# Altium project headphones.PrjPcb
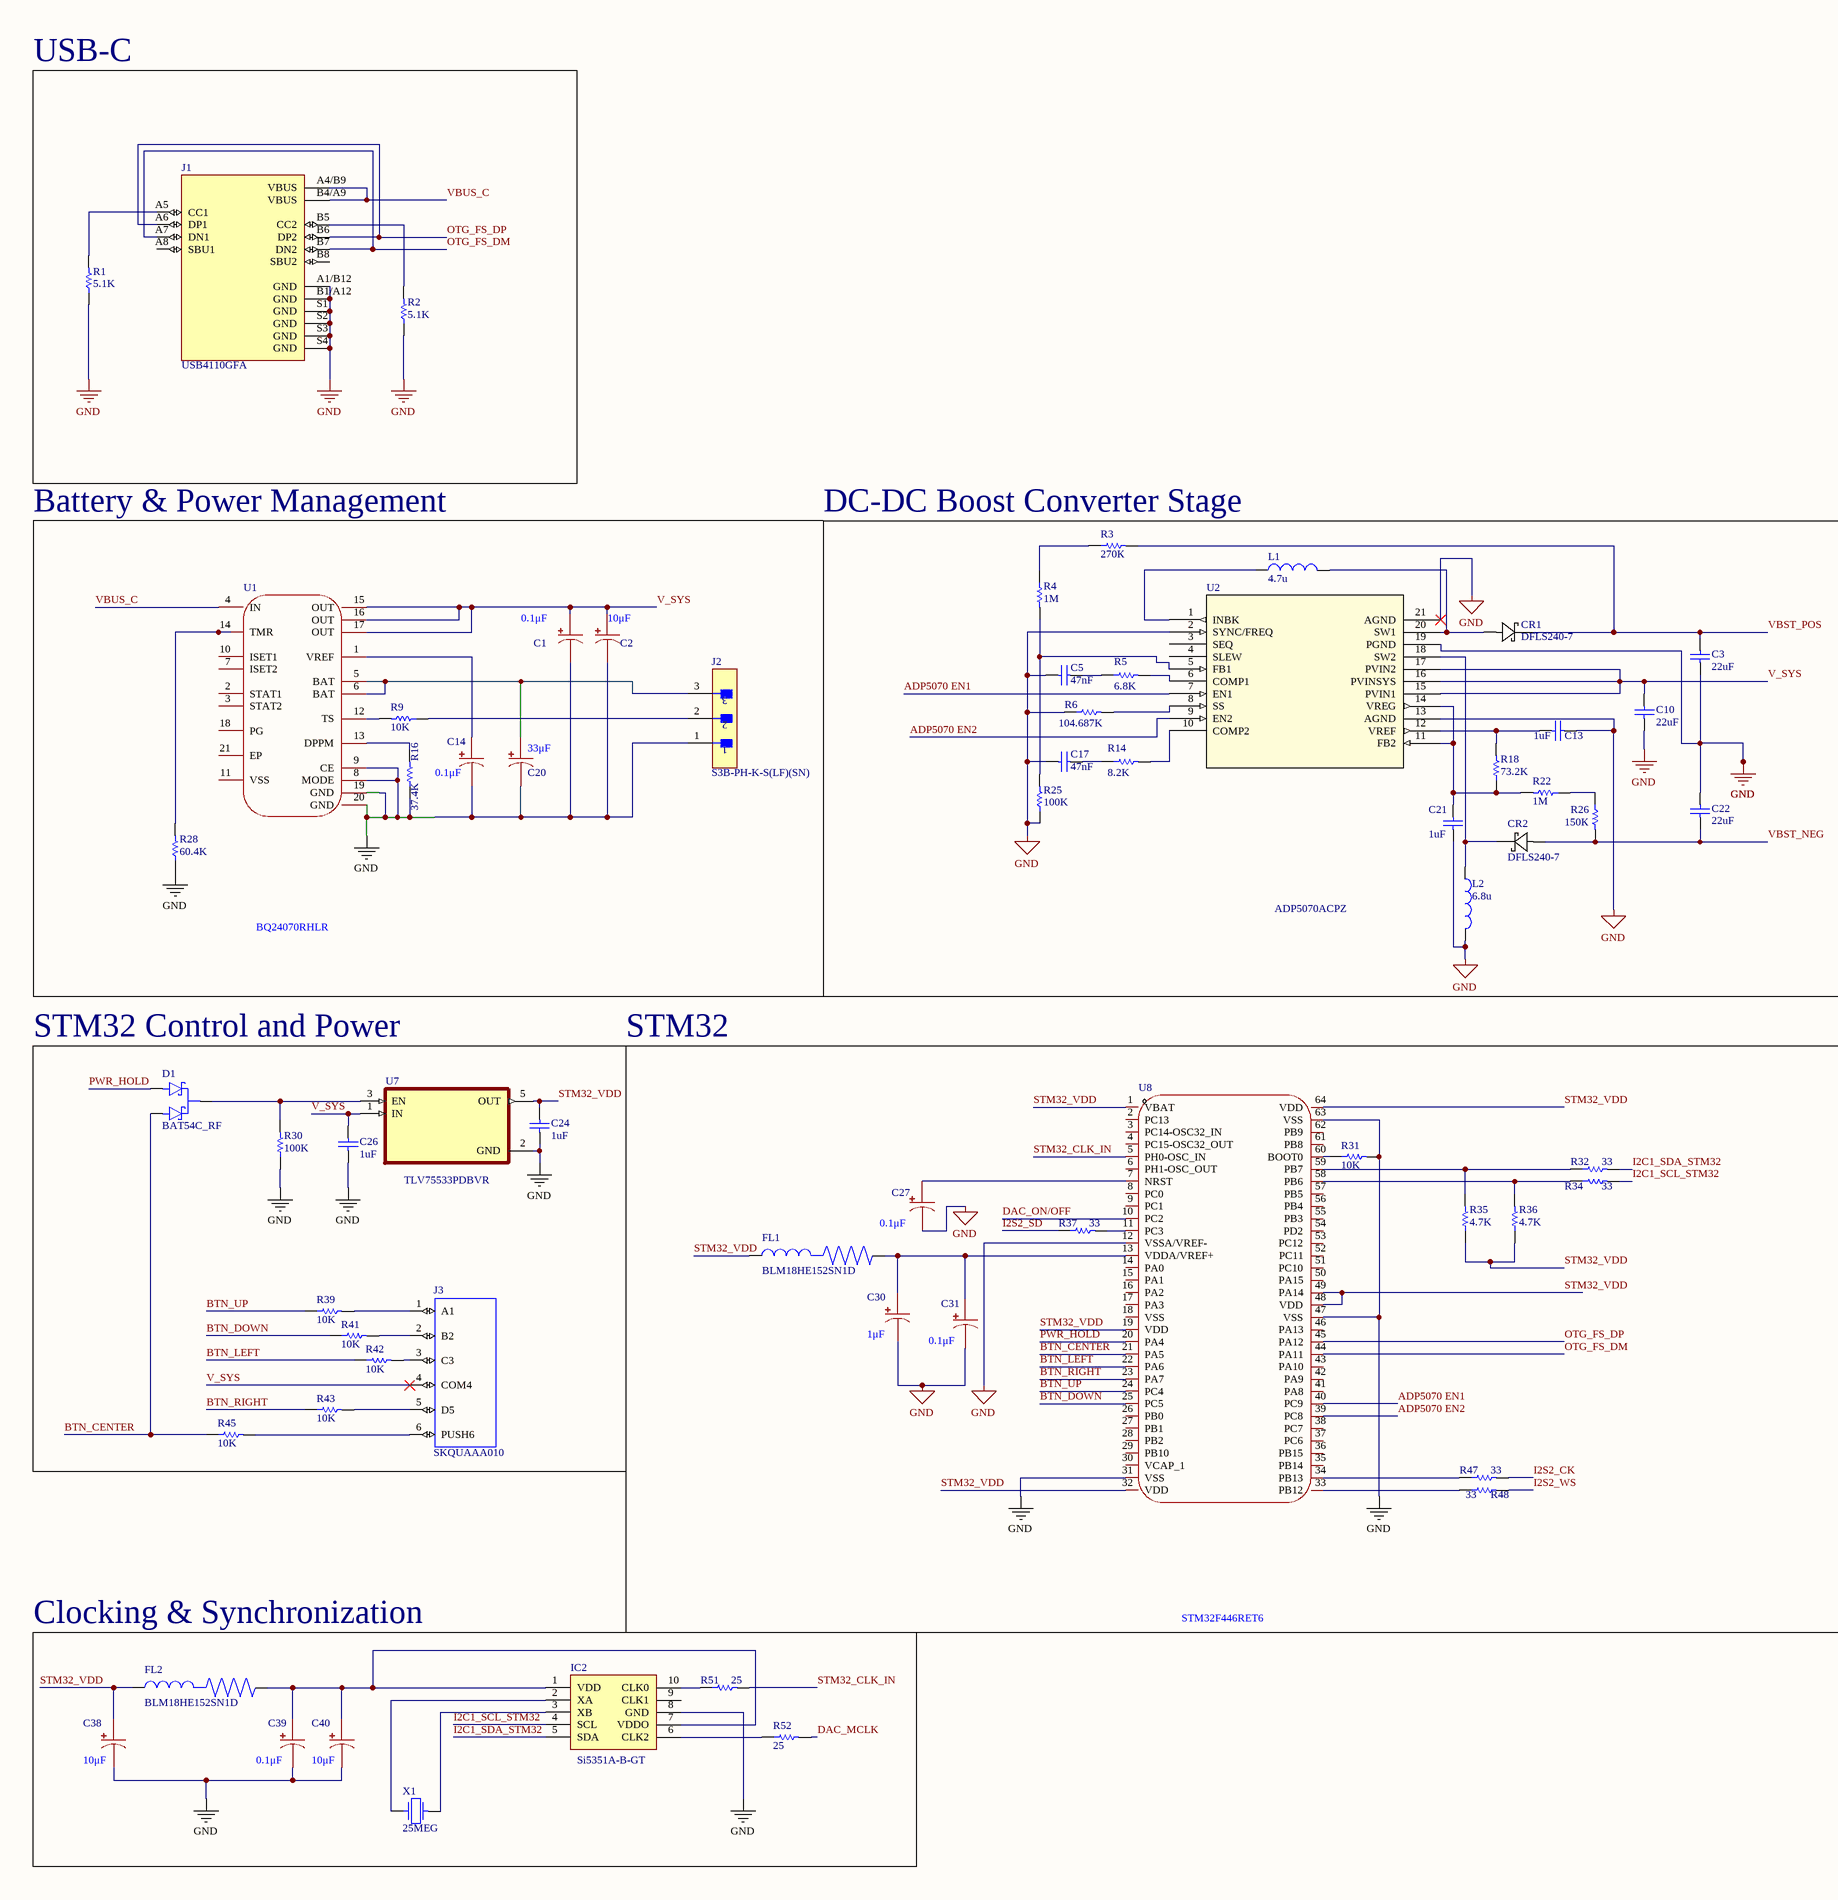
[diagram p0: 1_P1.schdoc, left]
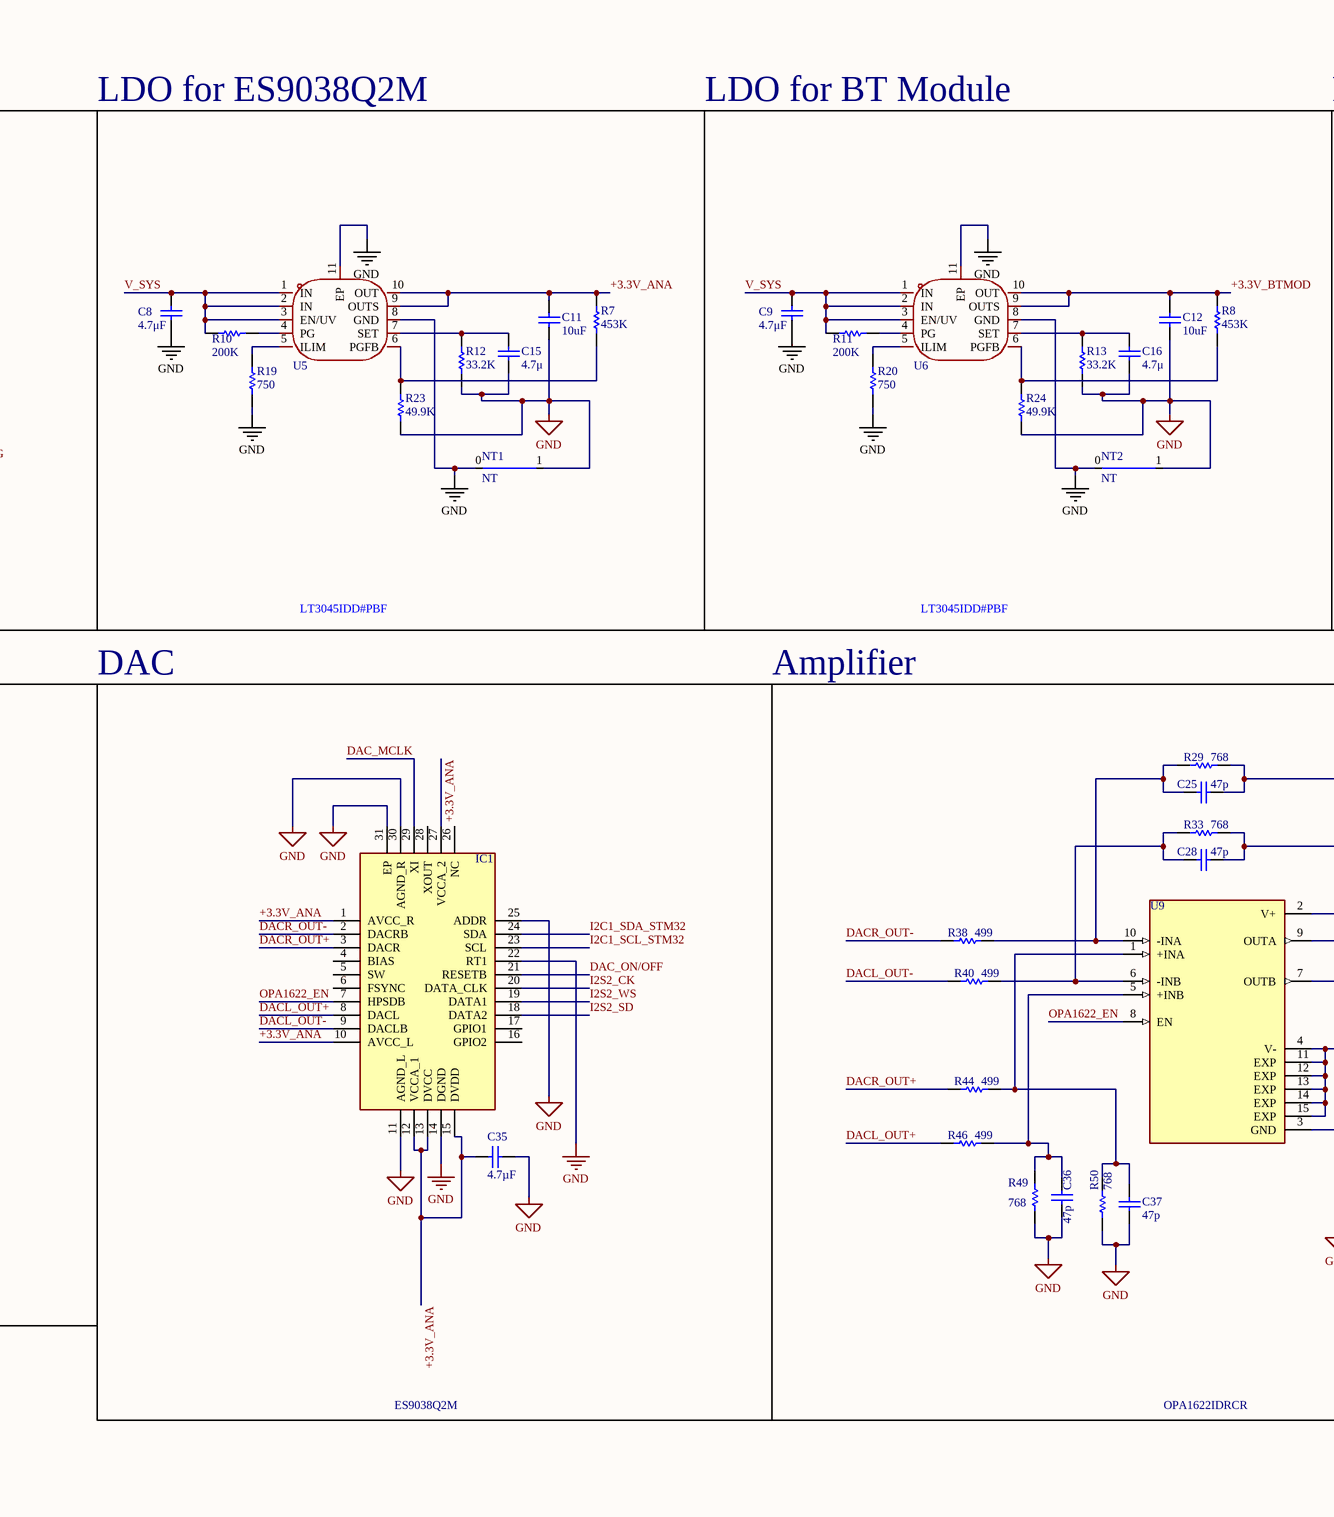
[diagram p1: 1_P1.schdoc, middle]
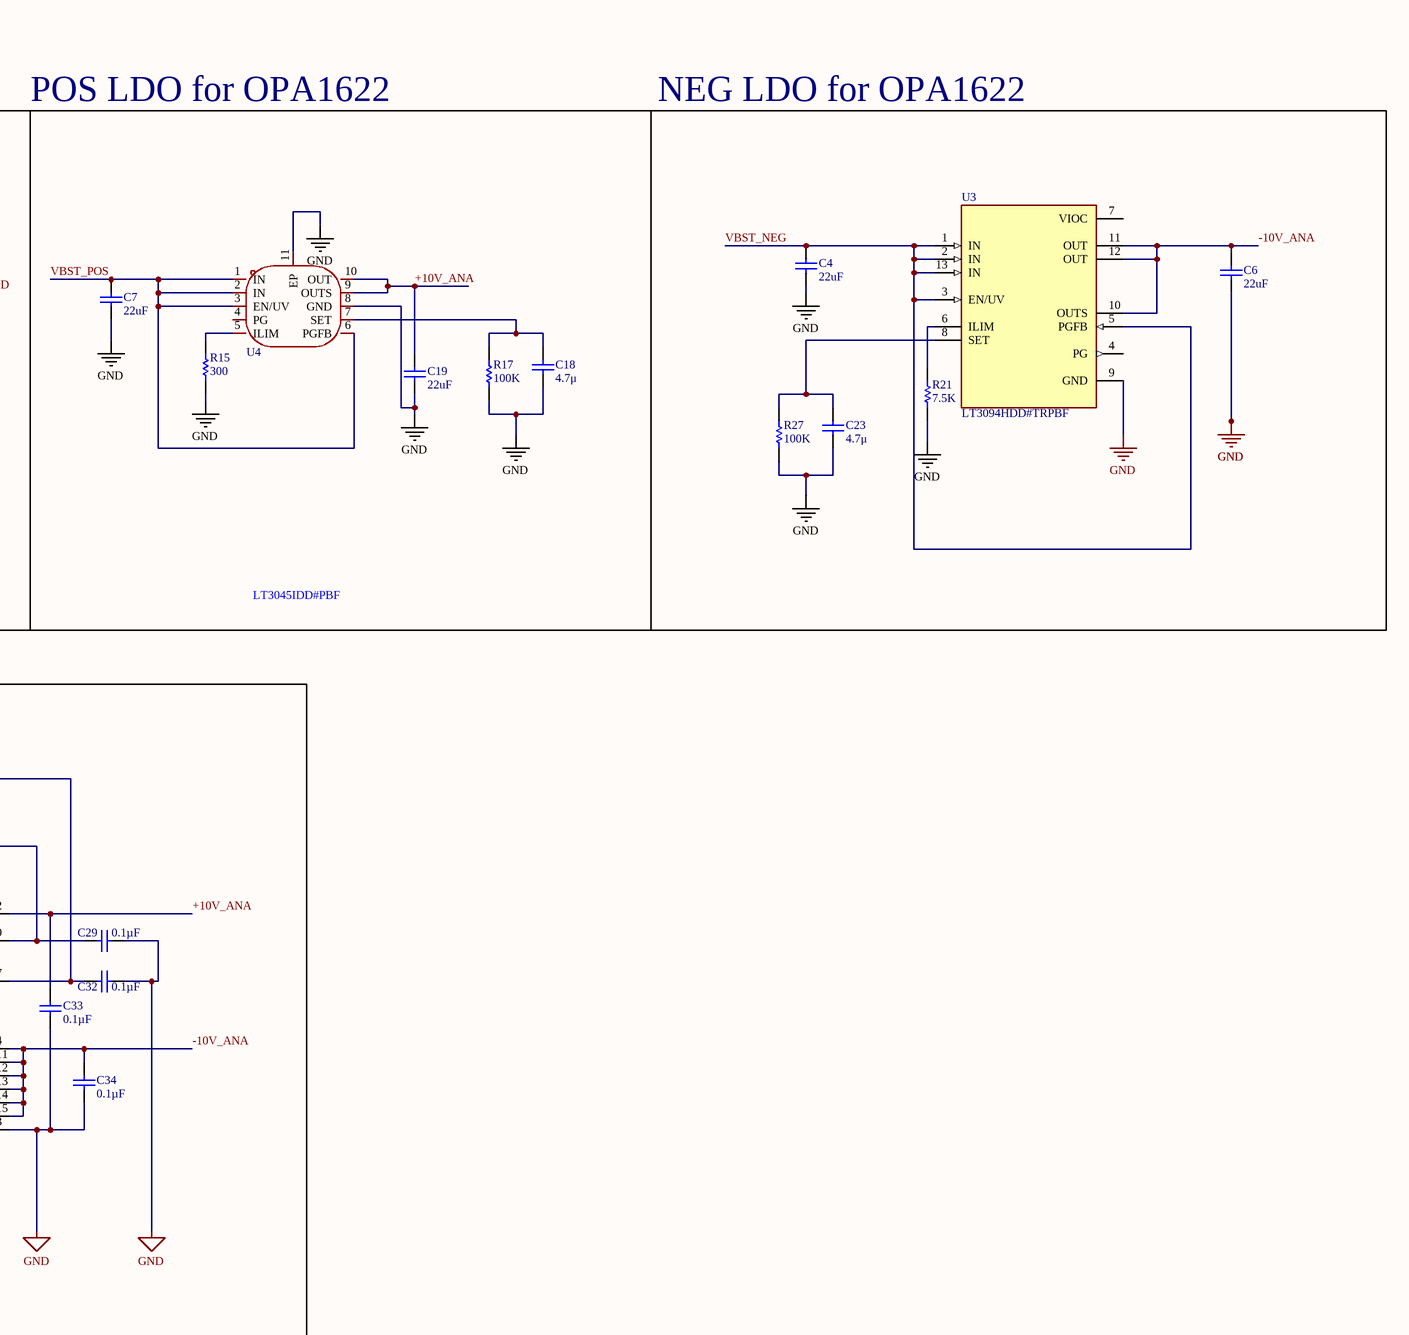
[diagram p2: 1_P1.schdoc, right]
1 sheet, 116 parts. Net scope: global (net labels, ports and power ports of the same name join across sheets).
Board file: PCB1.pcbdoc

## Sheet 1_P1.schdoc
size 1196 x 848 mm; Symbol: Drawing-Symbol_A4; Device: Drawing-Symbol_A4; @Project Name: onear_headphones; @Page Count: 1; @Update Date: 2026-01-30; @Create Date: 2025-10-09; @Schematic Name: Schematic1; @Page No: 1; @Page Name: P1; Company: EasyEDA.com; Version: V1.0; Page Size: A4; @Create Time: 20:19:40; @Update Time: 09:32:09; Width: 4676; Height: 3304; Region Start: 1; X Region Count: 6; Y Region Count: 4; Blade Width: 10; Title Block Position: 3; @Board Name: Board1; SheetNumber: 1; SheetTotal: 1

### Parts
C1  0.1μF  [FP-GRM155-0_05-MFG]
C2  10μF  [CAPC2012X145N]
C3  value 22uF  [FP-GRM32-MFG]  (hidden comment: Capacitor)
C4  value 22uF  [FP-GRM32-MFG]  (hidden comment: Capacitor)
C5  value 47nF  [FP-GRM155-0_05-MFG]  (hidden comment: Capacitor)
C6  value 22uF  [FP-GRM32-MFG]  (hidden comment: Capacitor)
C7  value 22uF  [FP-GRM32-MFG]  (hidden comment: Capacitor)
C8  value 4.7μF  [CAPC1608X95N]  (hidden comment: Capacitor)
C9  value 4.7μF  [CAPC1608X95N]  (hidden comment: Capacitor)
C10  value 22uF  [FP-GRM32-MFG]  (hidden comment: Capacitor)
C11  value 10uF  [FP-GRM32-MFG]  (hidden comment: Capacitor)
C12  value 10uF  [FP-GRM32-MFG]  (hidden comment: Capacitor)
C13  value 1uF  [CAPC1608X90N]  (hidden comment: Capacitor)
C14  0.1μF  [FP-GRM155-0_05-MFG]
C15  value 4.7μ  [FP-CL10-IPC_B]  (hidden comment: Capacitor)
C16  value 4.7μ  [FP-CL10-IPC_B]  (hidden comment: Capacitor)
C17  value 47nF  [FP-GRM155-0_05-MFG]  (hidden comment: Capacitor)
C18  value 4.7μ  [FP-CL10-IPC_B]  (hidden comment: Capacitor)
C19  value 22uF  [FP-GRM32-MFG]  (hidden comment: Capacitor)
C20  33μF  [CAPMP7.6X4.3_3.1N_KEM]
C21  value 1uF  [CAPC1608X90N]  (hidden comment: Capacitor)
C22  value 22uF  [FP-GRM32-MFG]  (hidden comment: Capacitor)
C23  value 4.7μ  [FP-CL10-IPC_B]  (hidden comment: Capacitor)
C24  value 1uF  [CAPC1608X90N]  (hidden comment: Capacitor)
C25  value 47p  [FP-GCM155-0_05-MFG]  (hidden comment: Capacitor)
C26  value 1uF  [CAPC1608X90N]  (hidden comment: Capacitor)
C27  0.1μF  [FP-GRM155-0_05-MFG]
C28  value 47p  [FP-GCM155-0_05-MFG]  (hidden comment: Capacitor)
C29  value 0.1µF  [FP-GRM155-0_05-MFG]  (hidden comment: Capacitor)
C30  1μF  [FP-C0402C-BB-MFG]
C31  0.1μF  [FP-GRM155-0_05-MFG]
C32  value 0.1µF  [FP-GRM155-0_05-MFG]  (hidden comment: Capacitor)
C33  value 0.1µF  [FP-GRM155-0_05-MFG]  (hidden comment: Capacitor)
C34  value 0.1µF  [FP-GRM155-0_05-MFG]  (hidden comment: Capacitor)
C35  value 4.7µF  [FP-CL10-IPC_B]  (hidden comment: Capacitor)
C36  value 47p  [FP-GCM155-0_05-MFG]  (hidden comment: Capacitor)
C37  value 47p  [FP-GCM155-0_05-MFG]  (hidden comment: Capacitor)
C38  10μF  [FP-CL21B106KOQNNNE-MFG]
C39  0.1μF  [FP-GRM155-0_05-MFG]
C40  10μF  [FP-CL21B106KOQNNNE-MFG]
CR1  DFLS240-7  [POWERDI123_DIO]
CR2  DFLS240-7  [POWERDI123_DIO]
D1  BAT54C_RF  [SOT95P237X112-3N]
FL1  BLM18HE152SN1D  [FP-BLM18-0_15-t0_8-MFG]
FL2  BLM18HE152SN1D  [FP-BLM18-0_15-t0_8-MFG]
IC1  ES9038Q2M  [QFN40P300X500X80-31N-D]
IC2  Si5351A-B-GT  [SOP50P490X110-10N]
J1  USB4110GFA  [GCT_USB4110GFA]
J2  S3B-PH-K-S(LF)(SN)  [FP-S3B-PH-K-S_LF_SN-MFG]
J3  SKQUAAA010  [SKQUAAA010]
L1  value 4.7u  [WE-MAPI_4030]  (hidden comment: Inductor)
L2  value 6.8u  [WE-MAPI_4030]  (hidden comment: Inductor)
NT1  NT  [NETTIE_SMD]  (net tie, no BOM)
NT2  NT  [NETTIE_SMD]  (net tie, no BOM)
R1  value 5.1K  [RESC1005X40X25NL05T10]  (hidden comment: Resistor)
R2  value 5.1K  [RESC1005X40X25NL05T10]  (hidden comment: Resistor)
R3  value 270К  [RES_RS73F_2B_KOA]  (hidden comment: Resistor)
R4  value 1M  [RESC3216X70X50NL20T25]  (hidden comment: Resistor)
R5  value 6.8K  [FP-RT0402-MFG]  (hidden comment: Resistor)
R6  value 104.687K  [ERA2AED122X]  (hidden comment: Resistor)
R7  value 453K  [ERA2AED122X]  (hidden comment: Resistor)
R8  value 453K  [ERA2AED122X]  (hidden comment: Resistor)
R9  value 10K  [RESC1005X40X25NL05T10]  (hidden comment: Resistor)
R10  value 200K  [RESC1005X40X25NL05T10]  (hidden comment: Resistor)
R11  value 200K  [RESC1005X40X25NL05T10]  (hidden comment: Resistor)
R12  value 33.2K  [0402_PAN]  (hidden comment: Resistor)
R13  value 33.2K  [0402_PAN]  (hidden comment: Resistor)
R14  value 8.2K  [FP-RT0402-MFG]  (hidden comment: Resistor)
R15  value 300  [RESC1005X40X25NL10T10]  (hidden comment: Resistor)
R16  value 37.4K  [0402_PAN]  (hidden comment: Resistor)
R17  value 100K  [FP-ERA2A-MFG]  (hidden comment: Resistor)
R18  value 73.2K  [ERA2AED122X]  (hidden comment: Resistor)
R19  value 750  [RESC1005X40X25NL10T10]  (hidden comment: Resistor)
R20  value 750  [RESC1005X40X25NL10T10]  (hidden comment: Resistor)
R21  value 7.5K  [FP-RT0402-MFG]  (hidden comment: Resistor)
R22  value 1M  [RESC3216X70X50NL20T25]  (hidden comment: Resistor)
R23  value 49.9K  [0402_PAN]  (hidden comment: Resistor)
R24  value 49.9K  [0402_PAN]  (hidden comment: Resistor)
R25  value 100K  [FP-ERA2A-MFG]  (hidden comment: Resistor)
R26  value 150К  [FP-ERA6A-MFG]  (hidden comment: Resistor)
R27  value 100K  [FP-ERA2A-MFG]  (hidden comment: Resistor)
R28  value 60.4K  [RESC1005X40X25NL05T10]  (hidden comment: Res_0603)
R29  value 768  [ERA2AED122X]  (hidden comment: Resistor)
R30  value 100K  [FP-ERA2A-MFG]  (hidden comment: Resistor)
R31  value 10K  [RESC1005X40X25NL05T10]  (hidden comment: Resistor)
R32  value 33  [FP-RT0402-MFG]  (hidden comment: Resistor)
R33  value 768  [ERA2AED122X]  (hidden comment: Resistor)
R34  value 33  [FP-RT0402-MFG]  (hidden comment: Resistor)
R35  value 4.7K  [RESC1005X40X25NL05T10]  (hidden comment: Resistor)
R36  value 4.7K  [RESC1005X40X25NL05T10]  (hidden comment: Resistor)
R37  value 33  [FP-RT0402-MFG]  (hidden comment: Resistor)
R38  value 499  [0402_PAN]  (hidden comment: Resistor)
R39  value 10K  [RESC1005X40X25NL05T10]  (hidden comment: Resistor)
R40  value 499  [0402_PAN]  (hidden comment: Resistor)
R41  value 10K  [RESC1005X40X25NL05T10]  (hidden comment: Resistor)
R42  value 10K  [RESC1005X40X25NL05T10]  (hidden comment: Resistor)
R43  value 10K  [RESC1005X40X25NL05T10]  (hidden comment: Resistor)
R44  value 499  [0402_PAN]  (hidden comment: Resistor)
R45  value 10K  [RESC1005X40X25NL05T10]  (hidden comment: Resistor)
R46  value 499  [0402_PAN]  (hidden comment: Resistor)
R47  value 33  [FP-RT0402-MFG]  (hidden comment: Resistor)
R48  value 33  [FP-RT0402-MFG]  (hidden comment: Resistor)
R49  value 768  [ERA2AED122X]  (hidden comment: Resistor)
R50  value 768  [ERA2AED122X]  (hidden comment: Resistor)
R51  value 25  [FP-RT0402-0_35-MFG]  (hidden comment: Resistor)
R52  value 25  [FP-RT0402-0_35-MFG]  (hidden comment: Resistor)
U1  BQ24070RHLR  [RHL0020A_V]
U2  ADP5070ACPZ  [CP-20-8_ADI]
U3  LT3094HDD#TRPBF  [SON45P300X300X80-13N]
U4  LT3045IDD#PBF  [FP-DD-10-05-08-1699-MFG]
U5  LT3045IDD#PBF  [FP-DD-10-05-08-1699-MFG]
U6  LT3045IDD#PBF  [FP-DD-10-05-08-1699-MFG]
U7  TLV75533PDBVR  [SOT95P280X145-5N]
U8  STM32F446RET6  [LQFP64-10x10mm]
U9  OPA1622IDRCR  [IC_OPA1622IDRCR]
X1  F0: 25MEG  [FP-NX3225SA-MFG]  (hidden comment: Crystal)

### Blocks framed on the sheet
USB-C: J1 R1 R2
Clocking & Synchronization: C38-C40 FL2 IC2 R51 R52 X1

### Nets
GND: C1.2 C2.2 C3.2 C4.1 C5.1 C6.1 C7.1 C8.1 C9.1 C10.2 C11.1 C12.1 C13.2 C14.2 C15.1 C16.1 C17.1 C18.1 C19.1 C20.2 C21.2 C22.1 C23.1 C24.1 C26.1 C27.2 C29.2 C30.2 C31.2 C32.2 C33.1 C34.1 C35.2 C36.1 C37.1 C38.2 C39.2 C40.2 IC1.11(AGND_L) IC1.14(DGND) IC1.22(RT1) IC1.25(ADDR) IC1.30(AGND_R) IC1.31(EP) IC2.8(GND) J1.A1/B12(GND) J1.B1/A12(GND) J1.S1(GND) J1.S2(GND) J1.S3(GND) J1.S4(GND) J2.1 L2.2 NT1.0 NT1.1 NT2.0 NT2.1 R1.1 R2.1 R6.1 R12.1 R13.1 R15.1 R16.1 R17.1 R19.1 R20.1 R21.1 R23.1 R24.1 R25.1 R27.1 R28.1 R30.1 R31.2 R49.1 R50.1 U1.8(MODE) U1.9(CE) U1.19(GND) U1.20(GND) U2.2(SYNC/FREQ) U2.13(AGND) U2.19(PGND) U2.21(AGND) U3.9(GND) U4.8(GND) U4.11(EP) U5.8(GND) U5.11(EP) U6.8(GND) U6.11(EP) U7.2(GND) U8.12(VSSA/VREF-) U8.31(VSS) U8.47(VSS) U8.63(VSS) U9.3(GND)
+3.3V_ANA: C11.2 C35.1 IC1.1(AVCC_R) IC1.10(AVCC_L) IC1.12(VCCA_1) IC1.13(DVCC) IC1.15(DVDD) IC1.27(VCCA_2) R7.2 U5.9(OUTS) U5.10(OUT)
+3.3V_BTMOD: C12.2 R8.2 U6.9(OUTS) U6.10(OUT)
+10V_ANA: C19.2 C33.2 U4.9(OUTS) U4.10(OUT) U9.2(V+)
-10V_ANA: C6.2 C34.2 U3.10(OUTS) U3.11(OUT) U3.12(OUT) U9.4(V-) U9.11(EXP) U9.12(EXP) U9.13(EXP) U9.14(EXP) U9.15(EXP)
ADP5070 EN1: U2.7(EN1) U8.40(PC9)
ADP5070 EN2: U2.9(EN2) U8.39(PC8)
BTN_CENTER: D1.2 R45.1 U8.21(PA5)
BTN_DOWN: R41.1 U8.25(PC5)
BTN_LEFT: R42.1 U8.22(PA6)
BTN_RIGHT: R43.1 U8.23(PA7)
BTN_UP: R39.1 U8.24(PC4)
DAC_MCLK: IC1.29(XI) R52.2
DAC_ON/OFF: IC1.21(RESETB) U8.10(PC2)
DACL_OUT+: IC1.8(DACL) R46.1
DACL_OUT-: IC1.9(DACLB) R40.1
DACR_OUT+: IC1.3(DACR) R44.1
DACR_OUT-: IC1.2(DACRB) R38.1
I2C1_SCL_STM32: IC1.23(SCL) IC2.4(SCL) R34.2
I2C1_SDA_STM32: IC1.24(SDA) IC2.5(SDA) R32.2
I2S2_CK: IC1.20(DATA_CLK) R47.2
I2S2_SD: IC1.18(DATA2) R37.1
I2S2_WS: IC1.19(DATA1) R48.2
OPA1622_EN: IC1.7(HPSDB) U9.8(EN)
OTG_FS_DM: J1.A7(DN1) J1.B7(DN2) U8.44(PA11)
OTG_FS_DP: J1.A6(DP1) J1.B6(DP2) U8.45(PA12)
PWR_HOLD: D1.1 U8.20(PA4)
STM32_CLK_IN: R51.2 U8.5(PH0-OSC_IN)
STM32_VDD: C24.2 C38.1 FL1.1 FL2.1 R35.1 R36.1 U7.5(OUT) U8.1(VBAT) U8.19(VDD) U8.32(VDD) U8.48(VDD) U8.49(PA14) U8.64(VDD)
V_SYS: C1.1 C2.1 C8.2 C9.2 C10.1 C26.2 J3.4(COM4) R10.1 R11.1 U1.15(OUT) U1.16(OUT) U1.17(OUT) U2.15(PVIN1) U2.16(PVINSYS) U2.17(PVIN2) U5.1(IN) U5.2(IN) U5.3(EN/UV) U6.1(IN) U6.2(IN) U6.3(EN/UV) U7.1(IN)
VBST_NEG: C4.2 C22.2 CR2.2 R26.2 U3.1(IN) U3.2(IN) U3.3(EN/UV) U3.5(PGFB) U3.13(IN)
VBST_POS: C3.1 C7.2 CR1.1 R3.2 U4.1(IN) U4.2(IN) U4.3(EN/UV) U4.6(PGFB)
VBUS_C: J1.A4/B9(VBUS) J1.B4/A9(VBUS) U1.4(IN)
NetC5_2: C5.2 R5.1
NetC13_1: C13.1 R18.2 U2.12(VREF)
NetC14_1: C14.1 U1.1(VREF)
NetC15_2: C15.2 R12.2 U5.7(SET)
NetC16_2: C16.2 R13.2 U6.7(SET)
NetC17_2: C17.2 R14.1
NetC18_2: C18.2 R17.2 U4.7(SET)
NetC20_1: C20.1 J2.3 U1.5(BAT) U1.6(BAT)
NetC21_1: C21.1 R18.1 R22.2 U2.11(FB2) U2.14(VREG)
NetC23_2: C23.2 R27.2 U3.8(SET)
NetC25_1: C25.1 R29.1 R38.2 U9.10(-INA)
NetC25_2: C25.2 C32.1 R29.2 U9.7(OUTB)
NetC27_1: C27.1 U8.7(NRST)
NetC28_1: C28.1 R33.1 R40.2 U9.6(-INB)
NetC28_2: C28.2 C29.1 R33.2 U9.9(OUTA)
NetC30_1: C30.1 C31.1 FL1.2 U8.13(VDDA/VREF+)
NetC36_2: C36.2 R46.2 R49.2 U9.5(+INB)
NetC37_2: C37.2 R44.2 R50.2 U9.1(+INA)
NetC39_1: C39.1 C40.1 FL2.2 IC2.1(VDD) IC2.7(VDDO)
NetCR1_2: CR1.2 L1.2 U2.20(SW1)
NetCR2_1: CR2.1 L2.1 U2.18(SW2)
NetD1_3: D1.3 R30.2 U7.3(EN)
NetIC2_2: IC2.2(XA) X1.2
NetIC2_3: IC2.3(XB) X1.1
NetIC2_6: IC2.6(CLK2) R52.1
NetIC2_10: IC2.10(CLK0) R51.1
NetJ1_A5: J1.A5(CC1) R1.2
NetJ1_B5: J1.B5(CC2) R2.2
NetJ2_2: J2.2 R9.1
NetJ3_1: J3.1(A1) R39.2
NetJ3_2: J3.2(B2) R41.2
NetJ3_3: J3.3(C3) R42.2
NetJ3_5: J3.5(D5) R43.2
NetJ3_6: J3.6(PUSH6) R45.2
NetL1_1: L1.1 U2.1(INBK)
NetR3_1: R3.1 R4.1
NetR4_2: R4.2 R25.2 U2.5(FB1)
NetR5_2: R5.2 U2.6(COMP1)
NetR6_2: R6.2 U2.8(SS)
NetR7_1: R7.1 R23.2 U5.6(PGFB)
NetR8_1: R8.1 R24.2 U6.6(PGFB)
NetR9_2: R9.2 U1.12(TS)
NetR10_2: R10.2 U5.4(PG)
NetR11_2: R11.2 U6.4(PG)
NetR14_2: R14.2 U2.10(COMP2)
NetR15_2: R15.2 U4.5(ILIM)
NetR16_2: R16.2 U1.13(DPPM)
NetR19_2: R19.2 U5.5(ILIM)
NetR20_2: R20.2 U6.5(ILIM)
NetR21_2: R21.2 U3.6(ILIM)
NetR22_1: R22.1 R26.1
NetR28_2: R28.2 U1.14(TMR)
NetR31_1: R31.1 U8.60(BOOT0)
NetR32_1: R32.1 R35.2 U8.59(PB7)
NetR34_1: R34.1 R36.2 U8.58(PB6)
NetR37_2: R37.2 U8.11(PC3)
NetR47_1: R47.1 U8.34(PB13)
NetR48_1: R48.1 U8.33(PB12)

Not connected (* = marked no-connect by the designer): IC1 4(BIAS) 5(SW) 6(FSYNC) 16(GPIO2) 17(GPIO1) 26(NC) 28(XOUT); IC2 9(CLK1); J1 A8(SBU1) B8(SBU2); U1 2(STAT1) 3(STAT2) 7(ISET2) 10(ISET1) 11(VSS) 18(PG) 21(EP); U2 3(SEQ) 4(SLEW); U3 4(PG) 7(VIOC); U4 4(PG); U8 2(PC13) 3(PC14-OSC32_IN) 4(PC15-OSC32_OUT) 6(PH1-OSC_OUT) 8(PC0) 9(PC1) 14(PA0) 15(PA1) 16(PA2) 17(PA3) 18(VSS) 26(PB0) 27(PB1) 28(PB2) 29(PB10) 30(VCAP_1) 35(PB14) 36(PB15) 37(PC6) 38(PC7) 41(PA8) 42(PA9) 43(PA10) 46(PA13) 50(PA15) 51(PC10) 52(PC11) 53(PC12) 54(PD2) 55(PB3) 56(PB4) 57(PB5) 61(PB8) 62(PB9)

### Notes on the sheet
- Battery & Power Management
- (near R3) DC-DC Boost Converter Stage
- LDO for ES9038Q2M
- LDO for BT Module
- POS LDO for OPA1622
- NEG LDO for OPA1622
- STM32 Control and Power
- STM32
- DAC
- Amplifier
- 1
- 2
- 3
- 4
- 5
- 6
- A
- B
- C
- D
- Schematic
- Schematic1
- Create at
- Update at
- 2025-10-09
- 2026-01-30
- Board
- Drawn
- Board1
- Page
- P1
- Reviewed
- Version
- Size
- onear_headphones
- Page  1  Total  1
- V1.0
- A4
- EasyEDA.com

### Library data of the parts
C1 C2 = UUG1J101MNQ1MS: Manufacturer: Nichicon(尼吉康); Add into BOM: yes; Value: 33μF; Tolerance: ±20%; Voltage Rating: 63V; Ripple Current: 370mA@120Hz; Lifetime: 2000hrs@85℃; Symbol: UUG1J101MNQ1MS; Device: UUG1J101MNQ1MS; LCSC Part Name: 100uF ±20% 63V; Manufacturer Part: UUG1J101MNQ1MS; Supplier Footprint: SMD,D12.5xL14.5mm; JLCPCB Part Class: Extended Part; Datasheet: https://item.szlcsc.com/datasheet/UUG1J101MNQ1MS/7537320.html; Supplier: LCSC; Convert to PCB: yes; Diameter: 12.5mm; Height - Seated (Max): 14.5mm; Operating Temperature: -40℃~+85℃
C3-C13 C15-C19 C21-C26 C28 C29 C32-C37 = Capacitor: SimulationGenericComponent: True
C14 C20 C27 C30 C31 C38-C40 = UUG1J101MNQ1MS: Manufacturer: Nichicon(尼吉康); Add into BOM: yes; Tolerance: ±20%; Voltage Rating: 63V; Ripple Current: 370mA@120Hz; Lifetime: 2000hrs@85℃; Symbol: UUG1J101MNQ1MS; Device: UUG1J101MNQ1MS; LCSC Part Name: 100uF ±20% 63V; Manufacturer Part: UUG1J101MNQ1MS; Supplier Footprint: SMD,D12.5xL14.5mm; JLCPCB Part Class: Extended Part; Datasheet: https://item.szlcsc.com/datasheet/UUG1J101MNQ1MS/7537320.html; Supplier: LCSC; Convert to PCB: yes; Diameter: 12.5mm; Height - Seated (Max): 14.5mm; Operating Temperature: -40℃~+85℃
  C14 C27 C31 C39: Value: 0.1μF
  C20: Value: 33μF
  C30: Value: 1μF
  C38 C40: Value: 10μF
CR1 CR2 = DFLS240-7: Description; Manufacturer_Name: Diodes Inc; Copyright: Copyright (C) 2026 Ultra Librarian. All rights reserved.; Manufacturer_Part_Number: DFLS240-7
D1 = BAT54C_RF: SOT-23, 30V, 0.2A, Schottky Diode; MF: Taiwan Semiconductor; MP: BAT54C RF; SnapEDA_Link: https://www.snapeda.com/parts/BAT54C%20RF/Taiwan+Semiconductor/view-part/?ref=snap; Package: SOT-23 Taiwan Semiconductor; Value: *; Check_prices: https://www.snapeda.com/parts/BAT54C%20RF/Taiwan+Semiconductor/view-part/?ref=eda
FL1 FL2 = BLM18HE152SN1D: 1.5 kOhms @ 100MHz 1 Signal Line Ferrite Bead 0603 (1608 Metric) 500mA 500mOhm; MF: Murata Electronics; MP: BLM18HE152SN1D; DigiKey-Purchase-URL: https://snapeda.com/shop?store=DigiKey&id=2740601; Package: 1608 Murata; Availability: Good; Price: None; Mouser-Purchase-URL: https://snapeda.com/shop?store=Mouser&id=2740601; Arrow_Electronics-Purchase-URL: https://snapeda.com/shop?store=Arrow+Electronics&id=2740601; SnapEDA_Link: https://www.snapeda.com/parts/BLM18HE152SN1D/Murata/view-part/2740601/?ref=snap; Value: *
IC1 = ES9038Q2M: Integrated Circuit; Manufacturer_Name: ESS Technology; Height: 0.8mm; Manufacturer_Part_Number: ES9038Q2M; Mouser Part Number: 460-ES9038Q2M; Mouser Price/Stock: https://www.mouser.co.uk/ProductDetail/ESS-Technology/ES9038Q2M?qs=sPbYRqrBIVmdeUedURuuOw%3D%3D
IC2 = Si5351A-B-GT: Integrated Circuit; Manufacturer_Name: Silicon Labs; Datasheet Link: https://componentsearchengine.com/Datasheets/1/Si5351A-B-GT.pdf; Height: 1.1mm; Manufacturer_Part_Number: Si5351A-B-GT; Mouser Part Number: 634-SI5351A-B-GT; Mouser Price/Stock: https://www.mouser.co.uk/ProductDetail/Silicon-Labs/SI5351A-B-GT?qs=p9T7GgSe1IEO%252BMfC%2FKPFfA%3D%3D; Arrow Part Number: SI5351A-B-GT; Arrow Price/Stock: https://www.arrow.com/en/products/si5351a-b-gt/silicon-labs
J1 = USB4110GFA: USB-C (USB TYPE-C) USB 2.0 Receptacle Connector 24 (16+8 Dummy) Position Surface Mount, Right Angle; MF: Global Connector Technology; SnapEDA_Link: https://www.snapeda.com/parts/USB4110GFA/Global+Connector+Technology/view-part/?ref=snap; Package: None; Value: *; MP: USB4110GFA; Check_prices: https://www.snapeda.com/parts/USB4110GFA/Global+Connector+Technology/view-part/?ref=eda
J2 = CMP-17439-000039-1: CONN HEADER R/A 3POS 2MM; Height: 0.31inch; Weight: 0.0625lb; Length: 0.31inch; Width: 0.31inch
L1 L2 = Inductor: SimulationGenericComponent: True
NT1 NT2 = NetTie_SMD: Net Tie SMD
R1-R52 = Resistor: TC1: 0; SimulationGenericComponent: True; TC2: 0
U1 = BQ24070RHLR: Manufacturer: TI(德州仪器); Add into BOM: yes; The Chip Type: Charging IC; Voltage - Supply: 4.35V~16V; Charge Current - Max: 1.5A; Charging Saturation Voltage: 4.2V; Type of Battery: Lithium Battery; Number of Cells: 1; Battery Temperature Detection: Support; Supply Current (Iq): 1mA; Symbol: BQ24070RHLR; Device: BQ24070RHLR; LCSC Part Name: 单芯片锂离子充电及系统电源路径管理IC; Supplier Part: C6514; Manufacturer Part: BQ24070RHLR; Supplier Footprint: QFN-20-EP(3.7x4.7); JLCPCB Part Class: Extended Part; Datasheet: https://www.ti.com/cn/lit/gpn/bq24070; Supplier: LCSC; Convert to PCB: yes; Operating Temperature: -40℃~+125℃
U2 = ADP5070ACPZ: 1 A/0.6 A, DC-to-DC Switching Regulator with Independent Positive and Negative Outputs; Manufacturer_Name: Analog Devices Inc; Type: Power Management; Copyright: Copyright (C) 2025 Ultra Librarian. All rights reserved.; Manufacturer_Part_Number: ADP5070ACPZ; RefDes: RefDes
U3 = LT3094HDD#TRPBF: âˆ’20V, 500mA, Ultralow Noise, Ultrahigh PSRR Negative Linear Regulator; MF: Analog Devices; Package: DFN -12 Analog Devices; Price: None; Check_prices: https://www.snapeda.com/parts/LT3094HDD%23TRPBF/Analog+Devices/view-part/?ref=eda; Value: *; SnapEDA_Link: https://www.snapeda.com/parts/LT3094HDD%23TRPBF/Analog+Devices/view-part/?ref=snap; MP: LT3094HDD#TRPBF; Availability: In Stock; Purchase-URL: https://pricing.snapeda.com/search?q=LT3094HDD#TRPBF&ref=eda
U4-U6 = LT3045IDD#PBF: Manufacturer: ADI(亚德诺); Add into BOM: yes; Output Type: Adjustable; Voltage - Supply: 20V; Output Voltage: 0V~15V; Output Current: 500mA; Power Supply Rejection Ratio (PSRR): 76dB@(1MHz); Voltage Dropout: 350mV@(500mA); standby current: 2.2mA; Noise: 0.8uVrms; Output Configuration: Positive; Number of Outputs: 1; Symbol: LT3045IDD#PBF; Device: LT3045IDD#PBF; LCSC Part Name: 20V、500mA、超低噪声、超高PSRR线性稳压器; Supplier Part: C580013; Manufacturer Part: LT3045IDD#PBF; Supplier Footprint: DFN-10-EP(3x3); JLCPCB Part Class: Extended Part; Datasheet: https://item.szlcsc.com/datasheet/LT3045IDD%2523PBF/607790.html; Supplier: LCSC; Convert to PCB: yes; Features: Short Circuit Protection；Over Current Protection；Reverse Polarity Protection；Over Temperature Protection; Operating Temperature: -40℃~+125℃@(Tj)
U7 = TLV75533PDBVR: 500-mA High-PSRR Low-IQ-Tief-Dropout-Spannungsregler mitablem; MF: Texas Instruments; SnapEDA_Link: https://www.snapeda.com/parts/TLV75533PDBVR/Texas+Instruments/view-part/?ref=snap; Package: SOT-23-5 Texas Instruments; Value: *; MP: TLV75533PDBVR; Check_prices: https://www.snapeda.com/parts/TLV75533PDBVR/Texas+Instruments/view-part/?ref=eda
U8 = STM32F446RET6: Manufacturer: ST(意法半导体); Add into BOM: yes; CPU Core: ARM-M4; CPU Maximum Speed: 180MHz; CPU Bit Width: 32bit; Program Storage Size: 512KB; Program Memory Type: FLASH; Number of I/O: 50; ADC (Bit): 12bit; Voltage - Supply: 1.7V~3.6V; Symbol: STM32F446RET6; Device: STM32F446RET6; LCSC Part Name: MSL=3 带DSP和FPU的高性能基础系列ARM Cortex-M4 MCU，具有512 KB Flash、180 MHz CPU、ART加速器和双QSPI; Supplier Part: C69336; Manufacturer Part: STM32F446RET6; Supplier Footprint: LQFP-64(10x10); JLCPCB Part Class: Extended Part; Datasheet: https://item.szlcsc.com/datasheet/STM32F446RET6/70451.html; Supplier: LCSC; Convert to PCB: yes; DAC (Bit): 12bit; Applications: -
U9 = OPA1622IDRCR: SoundPlusâ„¢ Audio Operational Amplifier with High Performance, Low THD+N and Bipolar Input; MF: Texas Instruments; SnapEDA_Link: https://www.snapeda.com/parts/OPA1622IDRCR/Texas+Instruments/view-part/?ref=snap; Package: VSON-10 Texas Instruments; Value: *; MP: OPA1622IDRCR; Check_prices: https://www.snapeda.com/parts/OPA1622IDRCR/Texas+Instruments/view-part/?ref=eda
X1 = Crystal: R: 50; Q: 50K; SimulationGenericComponent: True
J3 = SKQUAAA010: Package: None; Price: None; Value: *; MP: SKQUAAA010; Availability: Unavailable